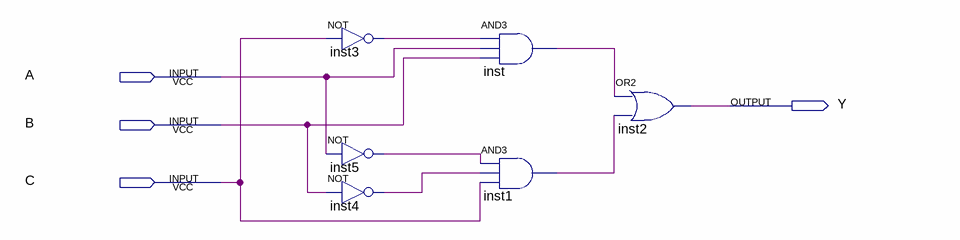
[diagram p0: schematic sheet]
// Quartus schematic Teste.bdf as structural Verilog: 6 symbols, 4 pins
module Teste (
  input  A,
  input  B,
  input  C,
  output Y
);

  wire inst1_out, inst3_out, inst4_out, inst5_out, inst_out;

  not inst3 (inst3_out, C);
  not inst5 (inst5_out, A);
  not inst4 (inst4_out, B);
  and inst (inst_out, inst3_out, A, B);
  and inst1 (inst1_out, inst5_out, inst4_out, C);
  or inst2 (Y, inst_out, inst1_out);
endmodule
